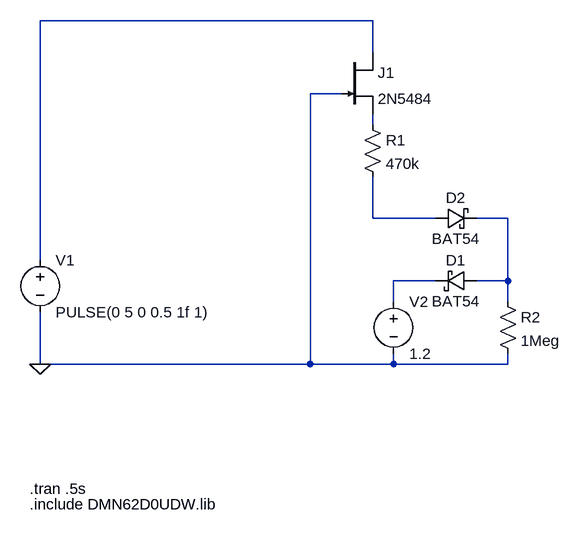
[diagram p0: schematic voltagesense.asc]
voltagesense.asc, the LTspice schematic file:
Version 4
SHEET 1 880 712
WIRE 96 -48 -416 -48
WIRE 96 0 96 -48
WIRE 48 64 0 64
WIRE 96 112 96 96
WIRE 96 256 96 192
WIRE 192 256 96 256
WIRE 304 256 256 256
WIRE -416 320 -416 -48
WIRE 192 352 128 352
WIRE 304 352 304 256
WIRE 304 352 256 352
WIRE 128 384 128 352
WIRE 304 384 304 352
WIRE -416 480 -416 400
WIRE 0 480 0 64
WIRE 0 480 -416 480
WIRE 128 480 128 464
WIRE 128 480 0 480
WIRE 304 480 304 464
WIRE 304 480 128 480
FLAG -416 480 0
SYMBOL voltage -416 304 R0
SYMATTR InstName V1
SYMATTR Value PULSE(0 5 0 0.5 1f 1)
SYMBOL res 80 96 R0
SYMATTR InstName R1
SYMATTR Value 470k
SYMBOL njf 48 0 R0
SYMATTR InstName J1
SYMATTR Value 2N5484
SYMBOL voltage 128 368 R0
SYMATTR InstName V2
SYMATTR Value 1.2
SYMBOL schottky 256 336 R90
WINDOW 0 0 32 VBottom 2
WINDOW 3 32 32 VTop 2
SYMATTR InstName D1
SYMATTR Value BAT54
SYMATTR Description Diode
SYMATTR Type diode
SYMBOL res 288 368 R0
SYMATTR InstName R2
SYMATTR Value 1Meg
SYMBOL schottky 192 272 R270
WINDOW 0 32 32 VTop 2
WINDOW 3 0 32 VBottom 2
SYMATTR InstName D2
SYMATTR Value BAT54
SYMATTR Description Diode
SYMATTR Type diode
TEXT -432 696 Left 2 !.include DMN62D0UDW.lib
TEXT -432 672 Left 2 !.tran .5s

The netlist it stands for:
* voltagesense.asc
V1 N001 0 PULSE(0 5 0 0.5 1f 1)
R1 N002 N003 470k
J1 N001 0 N002 2N5484
V2 N005 0 1.2
D1 N004 N005 BAT54
R2 N004 0 1Meg
D2 N003 N004 BAT54
.model D D
.lib standard.dio
.model NJF NJF
.model PJF PJF
.lib standard.jft
.include DMN62D0UDW.lib
.tran .5s
.backanno
.end